# EAGLE design Pcon (EAGLE 7.7.0)
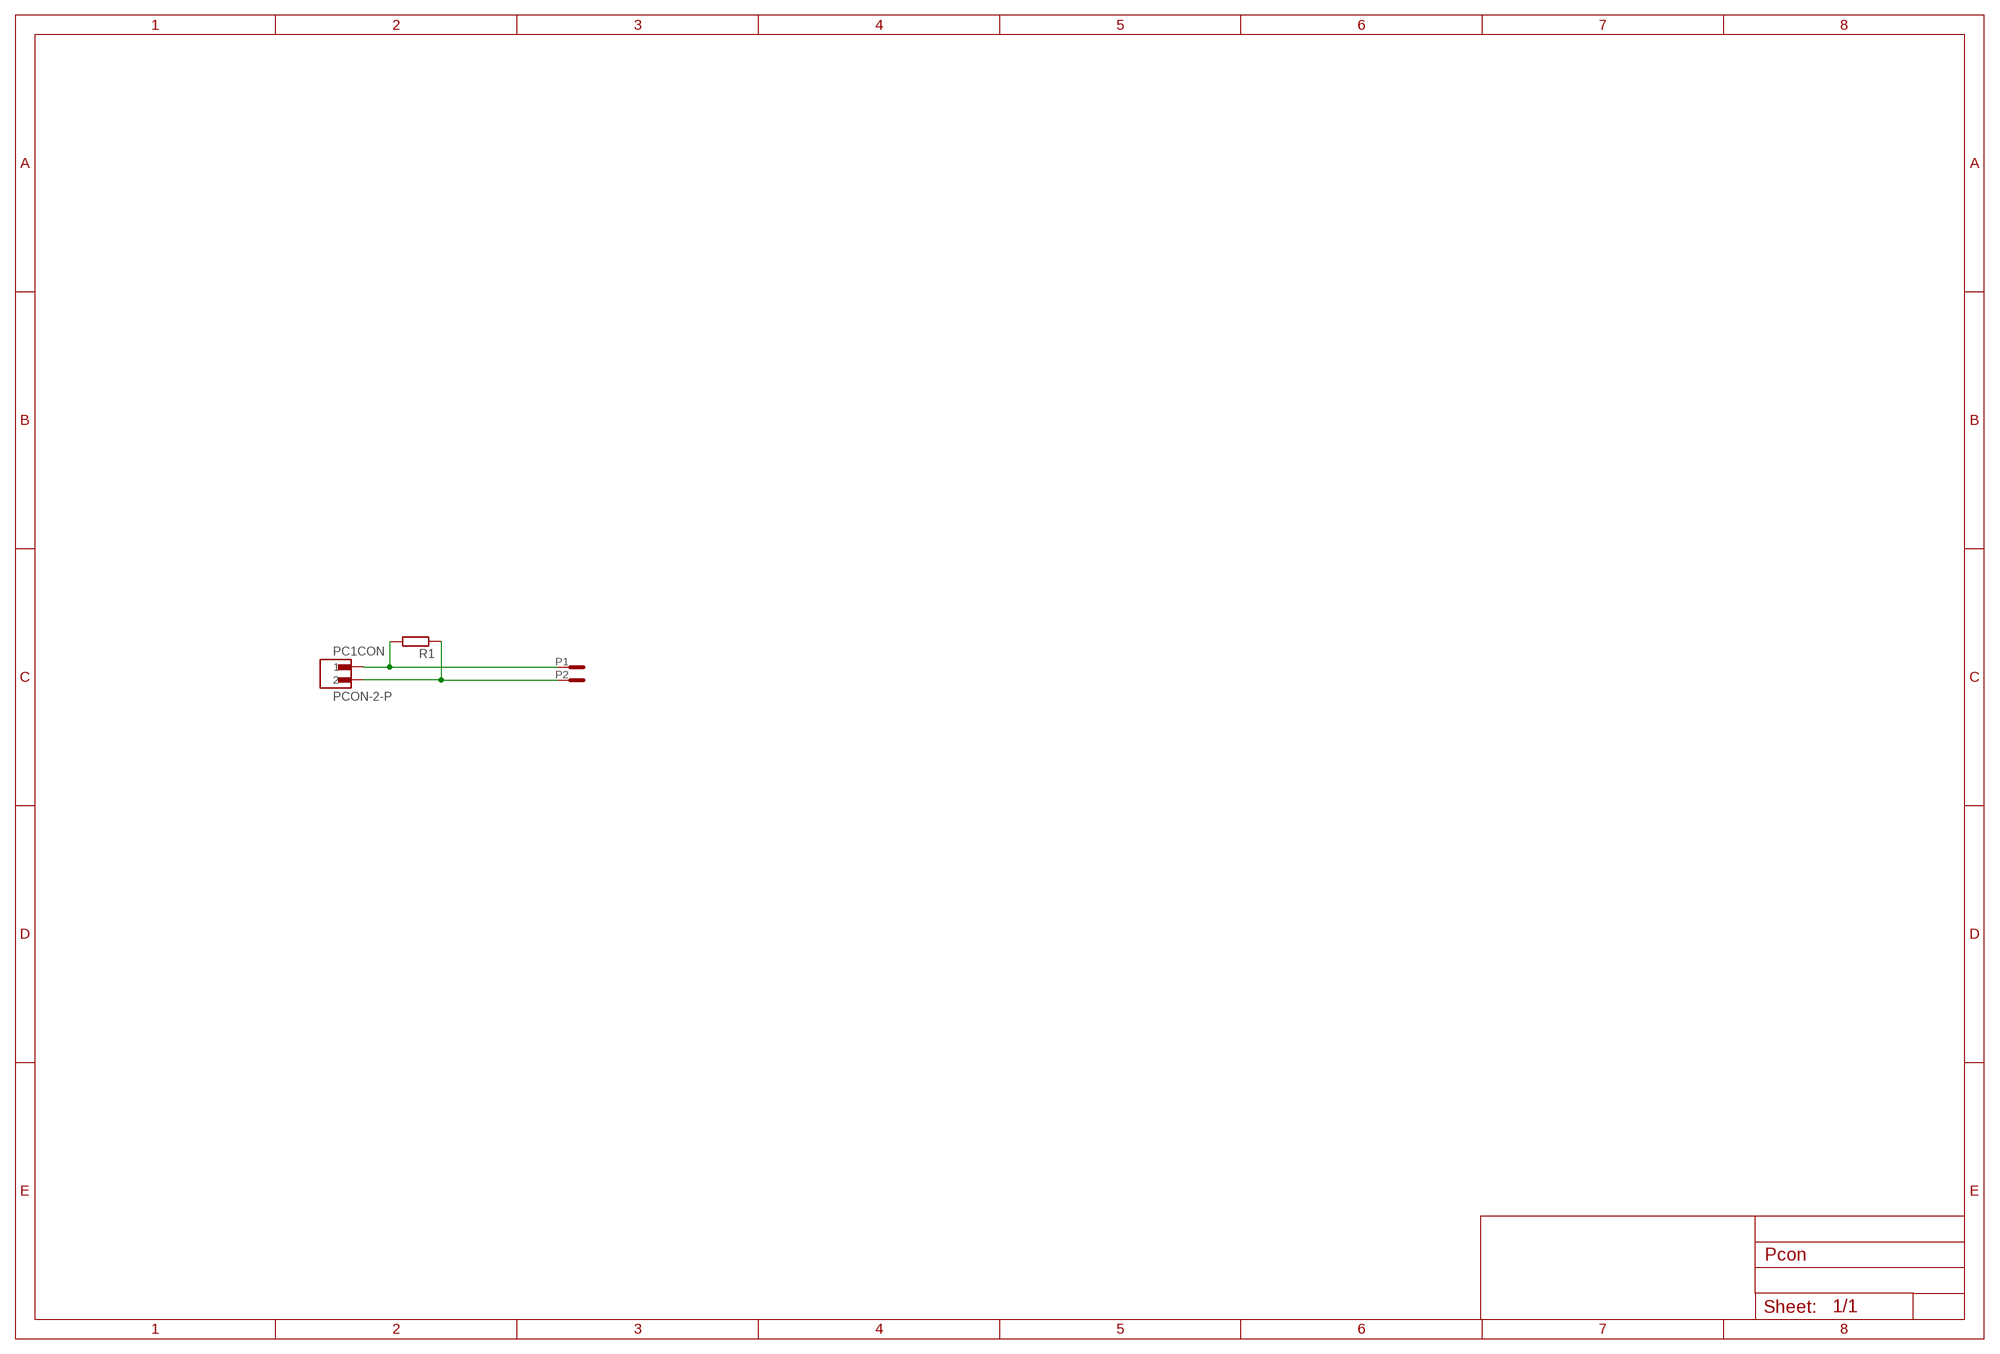
[diagram p0: schematic, sheet 1]

## Parts
PC1  PCON-2-P  [PCON-2]
R1  R-EU_R0603  [R0603]

## Nets
N$1: PC1.2 PC1.P2(P) R1.1
N$2: PC1.1 PC1.P1(P) R1.2

## Library data of the parts
PC1 = exmachina:PCON-2?
R1 = rcl:R-EU_: RESISTOR, European symbol

## Board
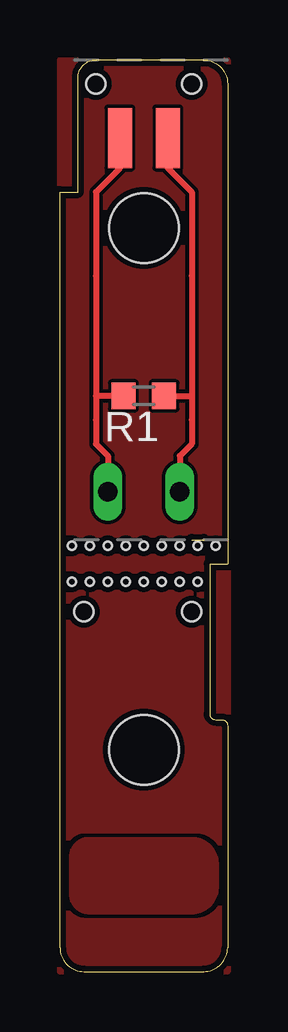
[diagram p1: board, top side]
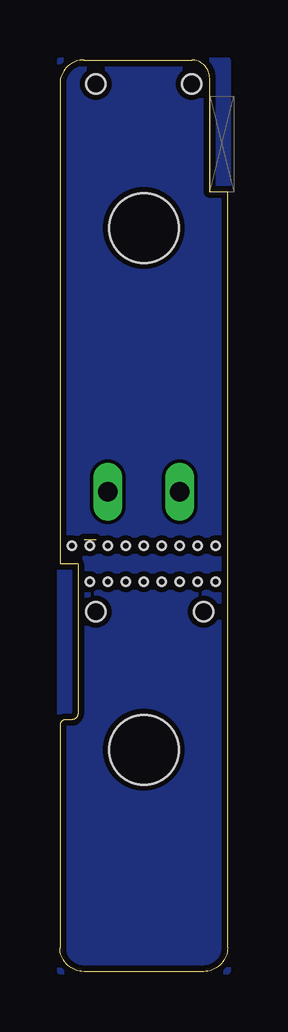
[diagram p2: board, bottom side, seen from below]

Size 7 x 38 mm. Coordinates in mm from the lower left corner, seen from the top.
Outline: 5.5,18 6,18
Outline: 0.75,32.5 0.75,37.25 arc-90 1.5,38 6,38 arc-90 7,37 7,17 6.25,17 6.25,10.75 arc90 6.5,10.5 6.75,10.5 arc-90 7,10.25 7,1 arc-90 6,0 1,0 arc-90 0,1 0,32.5 0.75,32.5
Copper layers (1*16): Top 0.018mm / dielectric 1.55mm / Bottom 0.018mm
Design rules "eC_2Layer_PClass6_BaseCopperO18_eCDefault *": minimum track width 0.15mm, minimum drill 0.35mm, track to track 0.15mm, track to pad 0.15mm, pad to pad 0.15mm, via to via 0.15mm, smd to smd 0mil, copper to edge 0.25mm, drill to drill 0.35mm, minimum pad ring 0.175mm, minimum via ring 0.125mm, stop-mask expansion 0mil, vias tented up to drill 0.45mm, thermal gap 0.2mm
Holes 2.9 mm at 3.5,9.25
Holes 0.8 mm at 5.5,15 1,15
Holes 0.35 mm at 2,17.75 3.5,17.75 5,17.75 0.5,17.75 2,16.25 3.5,16.25 5,16.25 0.5,16.25 6.5,17.75 2.75,17.75 4.25,17.75 5.75,17.75 1.25,17.75 2.75,16.25 4.25,16.25 5.75,16.25 1.25,16.25

### Footprints (pad centres in the part's own frame; a part is rotated, then mirrored left to right if it is on the bottom)
PCON-2 = smd 1 x 2.5: 1 -1,-2.25; 2 1,-2.25 | drill 0.8 long: P1 -1.5,-17; P2 1.5,-17 | hole 0.8: 2,0; -2,0 | hole 2.9: 0,-6
R0603 = smd 1 x 1.1: 1 -0.85,0; 2 0.85,0

### Placement (x,y rotation side)
PC1  3.5,37 0 top
R1  3.5,24 180 top

### Tracks (layer width: path | path; a pad name or v marks a point on that pad's centre or on a via)
GND
  pour Top (rank 6): 0,0 0,38 7,38 7,0
  pour Bottom (rank 6): 7,0 7,38 0,38 0,0
N$1
  Top 0.254: 5.5,29 5.5,24 | 5.5,24 5.5,23 | R1.1 5.5,24
N$2
  Top 0.254: 1.5,29 1.5,24 | 1.5,24 1.5,23 | R1.2 1.5,24
N$8
  pour Top (rank 2): 1.25,5.5 5.5,5.5 arc-90 6.5,4.5 6.5,3.5 arc-90 5.5,2.5 1.25,2.5 arc-90 0.5,3.25 0.5,4.75 arc-90